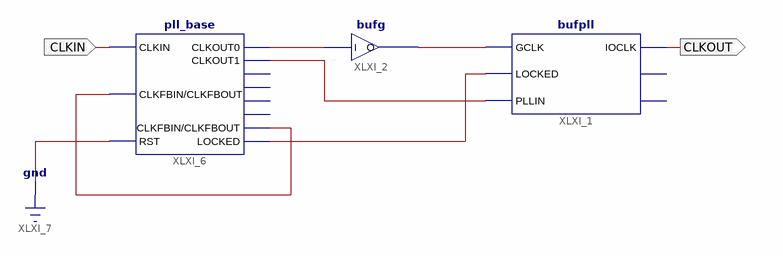
[diagram p0: schematic sheet 1]
// Xilinx ISE schematic FQFW.sch (spartan6) as structural Verilog: 3 symbols, 2 ports
module FQFW (
  input  CLKIN,
  output CLKOUT
);

  wire XLXN_1, XLXN_2, XLXN_3, XLXN_4, XLXN_5;

  bufpll XLXI_1 (.GCLK(XLXN_1), .LOCKED(XLXN_5), .PLLIN(XLXN_2), .IOCLK(CLKOUT));  // open: LOCK, SERDESSTROBE
  bufg XLXI_2 (.I(XLXN_4), .O(XLXN_1));
  pll_base #(.CLKFBOUT_MULT(4), .CLKIN_PERIOD(1)) XLXI_6 (
    .CLKIN(CLKIN), .CLKFBIN(XLXN_3), .RST(1'b0), .CLKOUT0(XLXN_4), .CLKOUT1(XLXN_2), .CLKFBOUT(XLXN_3),
    .LOCKED(XLXN_5));  // open: CLKOUT2, CLKOUT3, CLKOUT4, CLKOUT5
endmodule
